# Altium project RPi_CWHUSKY_Target.PrjPcb
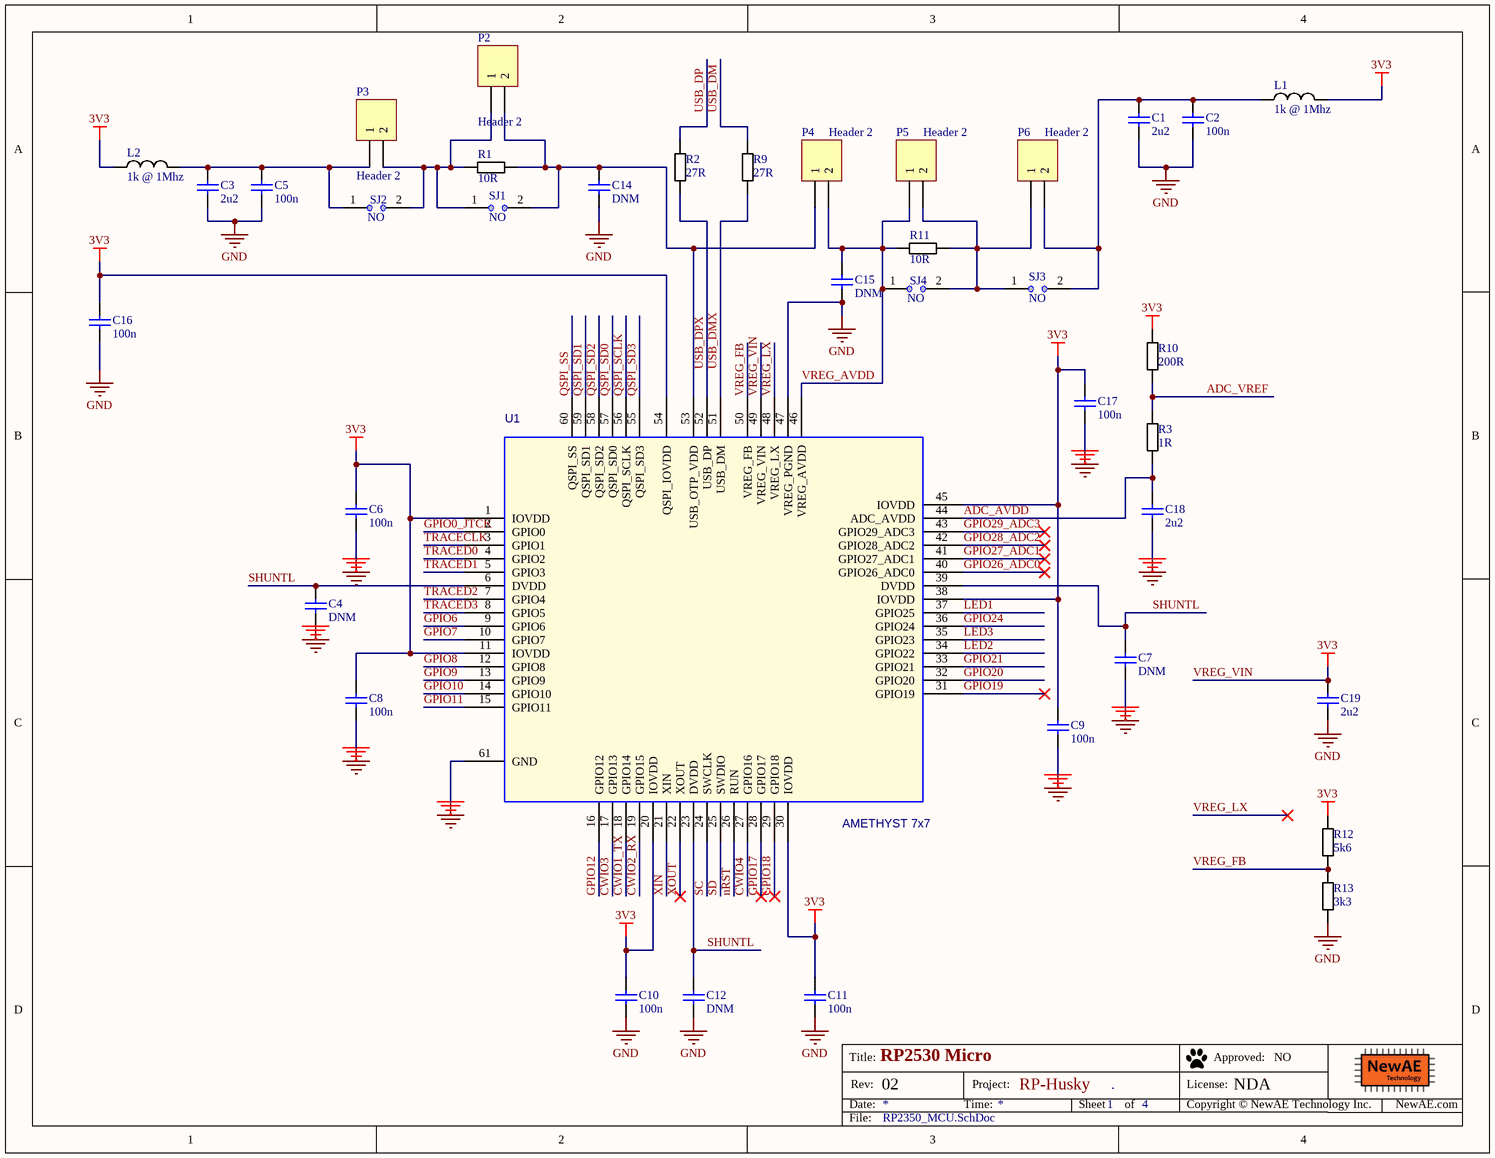
[diagram p0: RP2350_MCU.SchDoc]
PrjRev: 02; PrjName: RP-Husky; PrjLicense: NDA
4 sheets, 85 parts. Net scope: global (net labels, ports and power ports of the same name join across sheets).
Board file: RPi_CWHUSKY_Target.PcbDoc
Sheets:
  RP2350_MCU.SchDoc
  RP2350_CWHusky.SchDoc
  RP2350_Power.SchDoc
  RP2350_QSPI.SchDoc

## Sheet RP2350_MCU.SchDoc: RP2530 Micro
size Letter; Organization: NewAE Technology Inc.; Address1: 1083 Queen St., Suite 196; Address2: Halifax; Address3: NS; Address4: Canada B3H 0B2; DocumentNumber: .; Revision: .; SheetNumber: 1; SheetTotal: 4; SheetApproved: NO

### Parts
C1  2u2  [CAPC0603_M]
C2  100n  [CAPC0402_M]
C3  2u2  [CAPC0603_M]
C4  DNM  [CAPC0603_M]
C5  100n  [CAPC0402_M]
C6  100n  [CAPC0402_M]
C7  DNM  [CAPC0603_M]
C8  100n  [CAPC0402_M]
C9  100n  [CAPC0402_M]
C10  100n  [CAPC0402_M]
C11  100n  [CAPC0402_M]
C12  DNM  [CAPC0603_M]
C14  DNM  [CAPC0603_M]
C15  DNM  [CAPC0603_M]
C16  100n  [CAPC0402_M]
C17  100n  [CAPC0402_M]
C18  2u2  [CAPC0603_M]
C19  2u2  [CAPC0603_M]
L1  1k @ 1Mhz  [IND_0603]
L2  1k @ 1Mhz  [IND_0603]
P2  Header 2  [HDR1X2]
P3  Header 2  [HDR1X2]
P4  Header 2  [HDR1X2]
P5  Header 2  [HDR1X2]
P6  Header 2  [HDR1X2]
R1  10R  [RESC1608X55N]
R2  27R  [RESC1608X55N]
R3  1R  [RESC1608X55N]
R9  27R  [RESC1608X55N]
R10  200R  [RESC1608X55N]
R11  10R  [RESC1608X55N]
R12  5k6  [RESC1608X55N]
R13  3k3  [RESC1608X55N]
SJ1  NO  [SJ_2S_NO]  (no BOM)
SJ2  NO  [SJ_2S_NO]  (no BOM)
SJ3  NO  [SJ_2S_NO]  (no BOM)
SJ4  NO  [SJ_2S_NO]  (no BOM)
U1  AMETHYST 7x7  [QFN60P700X700X85_HS-61M]

### Nets
3V3: C6.1 C8.1 C9.1 C10.1 C11.1 C16.1 C17.1 C19.1 L1.2 L2.1 R10.1 R12.1 U1.1(IOVDD) U1.11(IOVDD) U1.20(IOVDD) U1.30(IOVDD) U1.38(IOVDD) U1.45(IOVDD) U1.49(VREG_VIN) U1.54(QSPI_IOVDD)  [also labelled VREG_VIN]  [project net IOVREF]
GND: C1.2 C2.2 C3.2 C4.2 C5.2 C6.2 C7.2 C8.2 C9.2 C10.2 C11.2 C12.2 C14.2 C15.2 C16.2 C17.2 C18.2 C19.2 R13.2 U1.47(VREG_PGND) U1.61(GND)
ADC_AVDD: C18.1 R3.1 U1.44(ADC_AVDD)
ADC_VREF: R3.2 R10.2
CWIO1_TX: U1.18(GPIO14)
CWIO2_RX: U1.19(GPIO15)
CWIO3: U1.17(GPIO13)
CWIO4: U1.27(GPIO16)
GPIO0_JTCK: U1.2(GPIO0)
GPIO6: U1.9(GPIO6)
GPIO7: U1.10(GPIO7)
GPIO8: U1.12(GPIO8)
GPIO9: U1.13(GPIO9)
GPIO10: U1.14(GPIO10)
GPIO11: U1.15(GPIO11)
GPIO12: U1.16(GPIO12)
GPIO17: U1.28(GPIO17)
GPIO18: U1.29(GPIO18)
GPIO19: U1.31(GPIO19)
GPIO20: U1.32(GPIO20)
GPIO21: U1.33(GPIO21)
GPIO24: U1.36(GPIO24)
GPIO26_ADC0: U1.40(GPIO26_ADC0)
GPIO27_ADC1: U1.41(GPIO27_ADC1)
GPIO28_ADC2: U1.42(GPIO28_ADC2)
GPIO29_ADC3: U1.43(GPIO29_ADC3)
LED1: U1.37(GPIO25)
LED2: U1.34(GPIO22)
LED3: U1.35(GPIO23)
nRST: U1.26(RUN)
QSPI_SCLK: U1.56(QSPI_SCLK)
QSPI_SD0: U1.57(QSPI_SD0)
QSPI_SD1: U1.59(QSPI_SD1)
QSPI_SD2: U1.58(QSPI_SD2)
QSPI_SD3: U1.55(QSPI_SD3)
QSPI_SS: U1.60(QSPI_SS)
SC: U1.24(SWCLK)
SD: U1.25(SWDIO)
SHUNTL: C4.1 C7.1 C12.1 U1.6(DVDD) U1.23(DVDD) U1.39(DVDD)
TRACECLK: U1.3(GPIO1)
TRACED0: U1.4(GPIO2)
TRACED1: U1.5(GPIO3)
TRACED2: U1.7(GPIO4)
TRACED3: U1.8(GPIO5)
USB_DM: R9.2
USB_DMX: R9.1 U1.51(USB_DM)
USB_DP: R2.2
USB_DPX: R2.1 U1.52(USB_DP)
VREG_AVDD: C15.1 P4.2 P5.1 R11.1 SJ4.1 U1.46(VREG_AVDD)
VREG_FB: R12.2 R13.1 U1.50(VREG_FB)
VREG_LX: U1.48(VREG_LX)
XIN: U1.21(XIN)
XOUT: U1.22(XOUT)
NetC1_1: C1.1 C2.1 L1.1 P6.2 SJ3.2
NetC3_1: C3.1 C5.1 L2.2 P3.1 SJ2.1
NetC14_1: C14.1 P2.2 P4.1 R1.2 SJ1.2 U1.53(USB_OTP_VDD)
NetP2_1: P2.1 P3.2 R1.1 SJ1.1 SJ2.2
NetP5_2: P5.2 P6.1 R11.2 SJ3.1 SJ4.2

### Notes on the sheet
- Title:
- Date:
- Rev:
- Time:
- Project:
- Sheet
- of
- License:
- Copyright © NewAE Technology Inc.
- Approved:
- NewAE.com
- File:

### Library data of the parts
C1 C3 C18 C19 = CCHIP-2u2-0603: 2u2, 0603; Manufacture 1: Samsung; Manufacture Part Number 1: CL10B225KP8NNNC; Component Group: Capacitor; Case-EIA: 0603; Case-Metric: 1608; Rated Voltage: 10VDC; Part Number: CCHIP-2u2-0603; Footprint: 0603; Pin Count: 2; Supplier 1: Digi-Key; Supplier Part Number 1: 1276-1134-1-ND; Value: 2u2; Mounting Technology: SMT; Component Kind: Standard; Component Type: Standard
C2 C5 C6 C8-C11 C16 C17 = CCHIP-100n-0402: 100n, 0402; Manufacture Part Number 1: CGA2B3X7R1V104K050BB; Component Group: Capacitor; Case-EIA: 0402; Part Number: CCHIP-100n-0402; Footprint: 0402; Pin Count: 2; Supplier 1: Digi-Key; Supplier Part Number 1: 445-6901-1-ND; Value: 100n; Mounting Technology: SMT; Component Kind: Standard; Component Type: Standard
C4 C7 C12 C14 C15 = CCHIP-DNM-0603: DNM, 0603; Component Group: Capacitor; Case-EIA: 0603; Part Number: CCHIP-DNM-0603; Footprint: 0603; Pin Count: 2; Value: DNM; Mounting Technology: SMT; Component Kind: Standard; Component Type: Standard
L1 L2 = FBCHIP-1k-0603: Ferrite Beads HI CUR CHIP BD 0603 1000OHMS 25%; Manufacture 1: Taiyo Yuden; Manufacture Part Number 1: FBMH1608HM102-T / FBMH1608HM102-T / FBMH1608HM102-T / FBMH1608HM102-T; Component Group: Inductor; PP Material Stack: 0; Part Number: FBCHIP-1k-0603; Footprint: 0603; Pin Count: 2; Supplier 1: Mouser; Supplier Part Number 1: 963-FBMH1608HM102-T; Mounting Technology: SMT; RoHS: Yes; Component Kind: Standard; Component Type: Standard; PP Rotation: 0
P2-P6 = Header 2: Header, 2-Pin; LatestRevisionDate: 17-Jul-2002; LatestRevisionNote: Re-released for DXP Platform.; Publisher: Altium Limited
R1 R11 = RCHIP-10R-0603: 10R res, 0603, 1%, 1/10W; Manufacture 1: Yageo; Manufacture Part Number 1: RC0603FR-0710RL; Component Group: Resistor; Case-EIA: 0603; Case-Metric: 1608; Rated Power: 0.1W; Rated Voltage: 75VDC; Part Number: RCHIP-10R-0603; Footprint: 0603; Pin Count: 2; Supplier 1: Digi-Key; Supplier Part Number 1: 311-10.0HRCT-ND; Value: 10R; Tolerance: 1%; Mounting Technology: SMT; Temperature Range: -55C to 155C; Component Kind: Standard; Component Type: Standard
R2 R9 = RCHIP-27R-0603: 27R res, 0603, 1%, 1/10W; Manufacture 1: Yageo; Manufacture Part Number 1: RC0603FR-0727RL; Component Group: Resistor; Case-EIA: 0603; Case-Metric: 1608; Rated Power: 0.1W; Rated Voltage: 75VDC; Part Number: RCHIP-27R-0603; Footprint: 0603; Pin Count: 2; Supplier 1: Digi-Key; Supplier Part Number 1: 311-27.0HRCT-ND; Value: 27R; Tolerance: 1%; Mounting Technology: SMT; Temperature Range: -55C to 155C; Component Kind: Standard; Component Type: Standard
R3 = RCHIP-10R-0603: 1R res, 0603, 1%, 1/10W; Manufacture 1: Yageo; Manufacture Part Number 1: RC0603FR-0710RL; Component Group: Resistor; Value: 10R; Case-EIA: 0603; Case-Metric: 1608; Rated Power: 0.1W; Rated Voltage: 75VDC; Part Number: RCHIP-10R-0603; Footprint: 0603; Pin Count: 2; Supplier 1: Digi-Key; Supplier Part Number 1: 311-10.0HRCT-ND; Tolerance: 1%; Mounting Technology: SMT; Temperature Range: -55C to 155C; Component Kind: Standard; Component Type: Standard
R10 = RCHIP-200R-0603: 200R res, 0603, 1%, 1/10W; Manufacture 1: Yageo; Manufacture Part Number 1: RC0603FR-07200RL; Component Group: Resistor; Case-EIA: 0603; Case-Metric: 1608; Rated Power: 0.1W; Rated Voltage: 75VDC; Part Number: RCHIP-200R-0603; Footprint: 0603; Pin Count: 2; Supplier 1: Digi-Key; Supplier Part Number 1: 311-200HRCT-ND; Value: 200R; Tolerance: 1%; Mounting Technology: SMT; Temperature Range: -55C to 155C; Component Kind: Standard; Component Type: Standard
R12 = RCHIP-5k6-0603: 5k6 res, 0603, 1%, 1/10W; Manufacture 1: Yageo; Manufacture Part Number 1: RC0603FR-075K6L; Component Group: Resistor; Case-EIA: 0603; Case-Metric: 1608; Rated Power: 0.1W; Rated Voltage: 75VDC; Part Number: RCHIP-5K6-0603; Footprint: 0603; Pin Count: 2; Mounting Technology: SMT; Component Kind: Standard; Component Type: Standard; Supplier 1: Digi-Key; Supplier Part Number 1: 311-5.60KHRCT-ND; Value: 5k6; Tolerance: 1%; Temperature Range: -55C to 155C
R13 = RCHIP-3k3-0603: 3k3 res, 0603, 1%, 1/10W; Manufacture 1: Yageo; Manufacture Part Number 1: RC0603FR-073K3L; Component Group: Resistor; Case-EIA: 0603; Case-Metric: 1608; Rated Power: 0.1W; Rated Voltage: 75VDC; Part Number: RCHIP-3K3-0603; Footprint: 0603; Pin Count: 2; Mounting Technology: SMT; Component Kind: Standard; Component Type: Standard; Supplier 1: Digi-Key; Supplier Part Number 1: 311-3.30KHRCT-ND; Value: 3k3; Tolerance: 1%; Temperature Range: -55C to 155C
SJ1-SJ4 = SJ_2S_NO: Solder Jumper, NO; Component Group: PCB Feature; Part Number: SJ_2S_NO; Pin Count: 2; Mounting Technology: COPPER; Component Type: Standard (No BOM)
U1 = RPI_AMETHYST-7X7: Part Reference: U1; PCB Footprint: rpi-amethyst-7x7qfn; Value: AMETHYST 7x7

## Sheet RP2350_CWHusky.SchDoc: CWHusky Edge Connector
size Letter; Organization: NewAE Technology Inc.; Address1: 1083 Queen St., Suite 196; Address2: Halifax; Address3: NS; Address4: Canada B3H 0B2; DocumentNumber: .; Revision: .; SheetNumber: 2; SheetTotal: 4; SheetApproved: NO
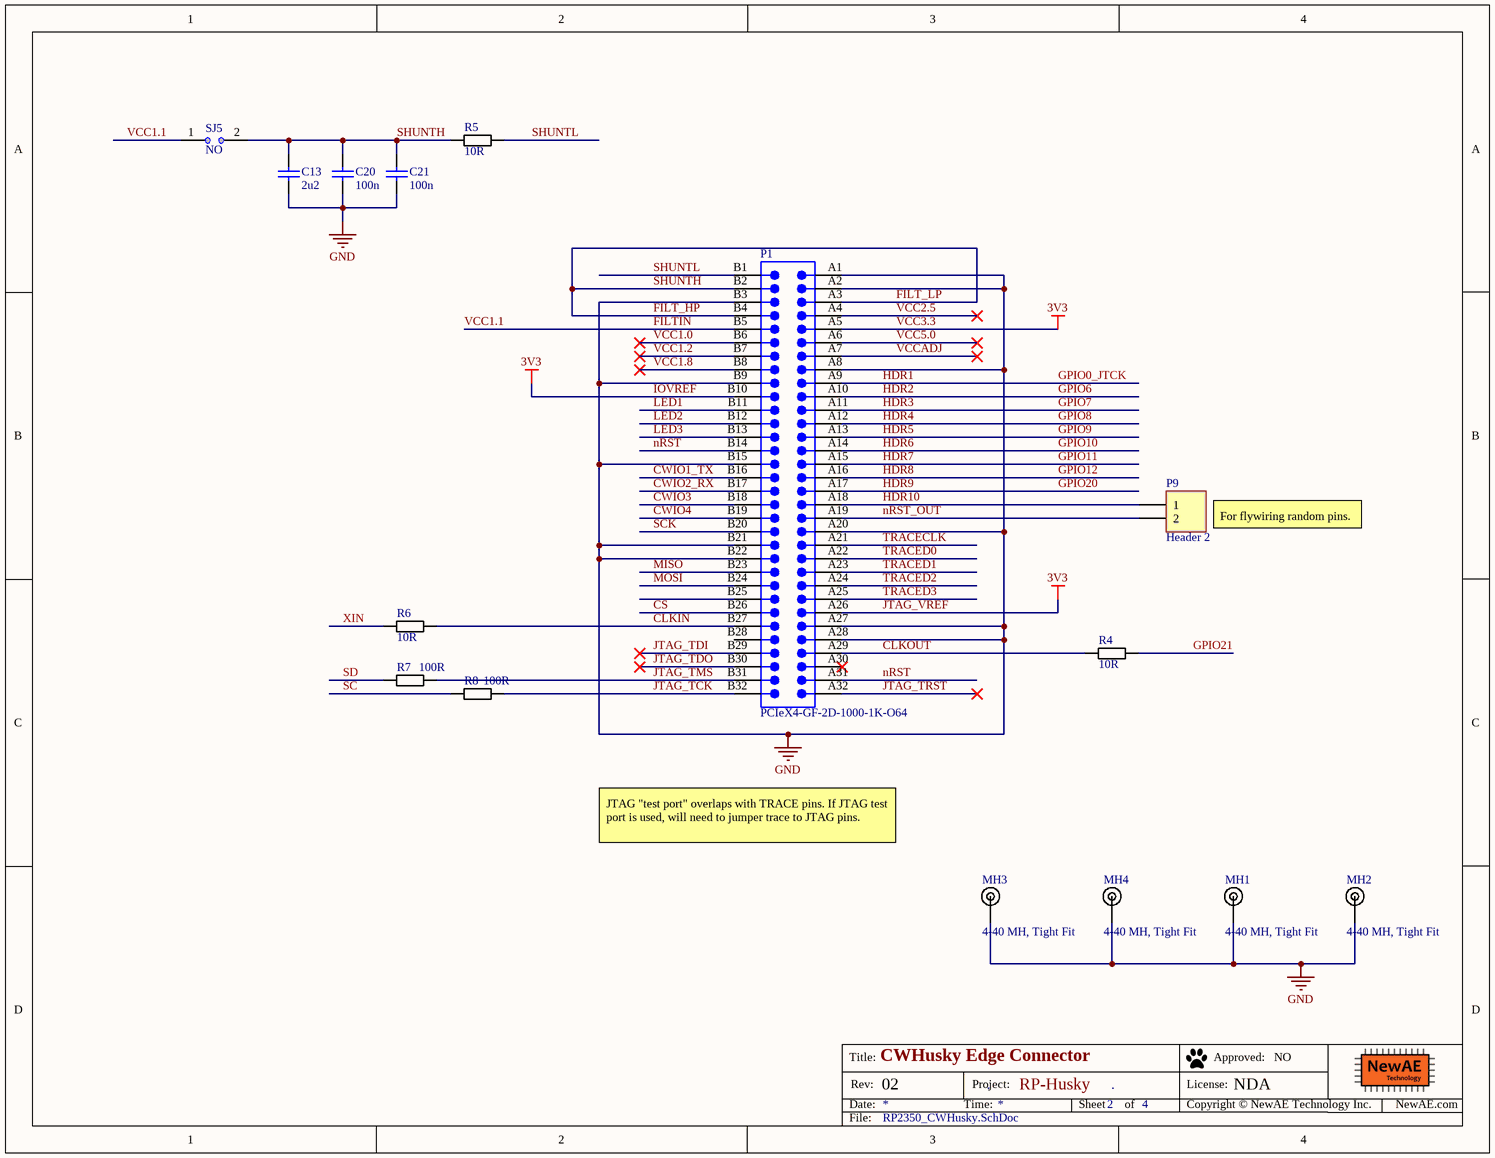
[diagram p1: RP2350_CWHusky.SchDoc]

### Parts
C13  2u2  [CAPC0603_M]
C20  100n  [CAPC0603_M]
C21  100n  [CAPC0603_M]
MH1  4-40 MH, Tight Fit  [MOUNT_#4_TIGHT]
MH2  4-40 MH, Tight Fit  [MOUNT_#4_TIGHT]
MH3  4-40 MH, Tight Fit  [MOUNT_#4_TIGHT]
MH4  4-40 MH, Tight Fit  [MOUNT_#4_TIGHT]
P1  PCIeX4-GF-2D-1000-1K-O64  [PCIeX4-GF-2D-1000-1K-O64]  (no BOM)
P9  Header 2  [HDR1X2]
R4  10R  [RESC1608X55N]
R5  10R  [RESC1608X55N]
R6  10R  [RESC1608X55N]
R7  100R  [RESC1608X55N]
R8  100R  [RESC1608X55N]
SJ5  NO  [SJ_2S_NO]  (no BOM)

### Nets
GND: C13.2 C20.2 C21.2 MH1.1 MH2.1 MH3.1 MH4.1 P1.A1 P1.A2 P1.A8 P1.A20 P1.A27 P1.A28 P1.B3 P1.B9 P1.B15 P1.B21 P1.B22
IOVREF: P1.A5 P1.A26 P1.B10  [also labelled 3V3, JTAG_VREF, VCC3.3]
CLKIN: P1.B27 R6.2
CLKOUT: P1.A29 R4.1
CS: P1.B26
CWIO1_TX: P1.B16
CWIO2_RX: P1.B17
CWIO3: P1.B18
CWIO4: P1.B19
FILT_HP: C13.1 C20.1 C21.1 P1.A3 P1.B2 P1.B4 R5.1 SJ5.2  [also labelled FILT_LP, SHUNTH]
FILTIN: P1.B5 SJ5.1  [also labelled VCC1.1]
GPIO0_JTCK: P1.A9  [also labelled HDR1]
GPIO6: P1.A10  [also labelled HDR2]
GPIO7: P1.A11  [also labelled HDR3]
GPIO8: P1.A12  [also labelled HDR4]
GPIO9: P1.A13  [also labelled HDR5]
GPIO10: P1.A14  [also labelled HDR6]
GPIO11: P1.A15  [also labelled HDR7]
GPIO12: P1.A16  [also labelled HDR8]
GPIO20: P1.A17  [also labelled HDR9]
GPIO21: R4.2
HDR10: P1.A18 P9.1
JTAG_TCK: P1.B32 R8.2
JTAG_TDI: P1.B29
JTAG_TDO: P1.B30
JTAG_TMS: P1.B31 R7.2
JTAG_TRST: P1.A32
LED1: P1.B11
LED2: P1.B12
LED3: P1.B13
MISO: P1.B23
MOSI: P1.B24
nRST: P1.A31 P1.B14
nRST_OUT: P1.A19 P9.2
SC: R8.1
SCK: P1.B20
SD: R7.1
SHUNTL: P1.B1 R5.2
TRACECLK: P1.A21
TRACED0: P1.A22
TRACED1: P1.A23
TRACED2: P1.A24
TRACED3: P1.A25
VCC1.0: P1.B6
VCC1.2: P1.B7
VCC1.8: P1.B8
VCC2.5: P1.A4
VCC5.0: P1.A6
VCCADJ: P1.A7
XIN: R6.1

Not connected (* = marked no-connect by the designer): P1 A30* B25 B28

### Notes on the sheet
- (near P9) For flywiring random pins.
- JTAG "test port" overlaps with TRACE pins. If JTAG test port is used, will need to jumper trace to JTAG pins.
- Title:
- Date:
- Rev:
- Time:
- Project:
- Sheet
- of
- License:
- Copyright © NewAE Technology Inc.
- Approved:
- NewAE.com
- File:

### Library data of the parts
C13 = CCHIP-2u2-0603: as C1 on sheet RP2350_MCU; Part Number: CCHIP-2u2-0603; Footprint: 0603; Pin Count: 2; Supplier 1: Digi-Key; Supplier Part Number 1: 1276-1134-1-ND; Value: 2u2; Mounting Technology: SMT; Component Kind: Standard; Component Type: Standard
C20 C21 = CCHIP-100n-0603: 100n, 0603; Manufacture 1: Kemet; Manufacture Part Number 1: C0603C104K5RACTU; Component Group: Capacitor; Case-EIA: 0603; Case-Metric: 1608; Rated Voltage: 50VDC; Part Number: CCHIP-100n-0603; Footprint: 0603; Pin Count: 2; Supplier 1: Digi-Key; Supplier Part Number 1: 399-5089-2-ND; Value: 100n; Mounting Technology: SMT; Component Kind: Standard; Component Type: Standard
MH1-MH4 = MOUNT_#4_TIGHT: Machine screw 4-40 Mounting Hole; Component Group: Mechanical; PP Material Stack: 0; Part Number: MOUNT_#4_TIGHT; Pin Count: 1; Component Kind: Mechanical; Component Type: Mechanical; PP Rotation: 0
P1 = CMP-0001-00031-2: Golden finger, PCIeX4, Dual, Opposite, Pitch 1mm, 64-Position; Mating Connector: Molex-87715-9106; Publisher: Altium; ClassName: Edge Connector; Datasheet Version: rev2.0, Apr-2007; Package Reference: PCIeX4-GF-2D-1000-1K-O64
P9 = Header 2: Header, 2-Pin; LatestRevisionDate: 17-Jul-2002; LatestRevisionNote: Re-released for DXP Platform.; Publisher: Altium Limited
R4-R6 = RCHIP-10R-0603: as R1 on sheet RP2350_MCU; Part Number: RCHIP-10R-0603; Footprint: 0603; Pin Count: 2; Supplier 1: Digi-Key; Supplier Part Number 1: 311-10.0HRCT-ND; Value: 10R; Tolerance: 1%; Mounting Technology: SMT; Temperature Range: -55C to 155C; Component Kind: Standard; Component Type: Standard
R7 R8 = RCHIP-100R-0603: 100R res, 0603, 1%, 1/10W; Manufacture 1: Yageo; Manufacture Part Number 1: RC0603FR-07100RL; Component Group: Resistor; Case-EIA: 0603; Case-Metric: 1608; Rated Power: 0.1W; Rated Voltage: 75VDC; Part Number: RCHIP-100R-0603; Footprint: 0603; Pin Count: 2; Supplier 1: Digi-Key; Supplier Part Number 1: 311-100HRCT-ND; Value: 100R; Tolerance: 1%; Mounting Technology: SMT; Temperature Range: -55C to 155C; Component Kind: Standard; Component Type: Standard
SJ5 = SJ_2S_NO: as SJ1 on sheet RP2350_MCU; Part Number: SJ_2S_NO; Pin Count: 2; Mounting Technology: COPPER; Component Type: Standard (No BOM)

## Sheet RP2350_Power.SchDoc: Power and USB
size Letter; Organization: NewAE Technology Inc.; Address1: 1083 Queen St., Suite 196; Address2: Halifax; Address3: NS; Address4: Canada B3H 0B2; DocumentNumber: .; Revision: .; SheetNumber: 3; SheetTotal: 4; SheetApproved: NO
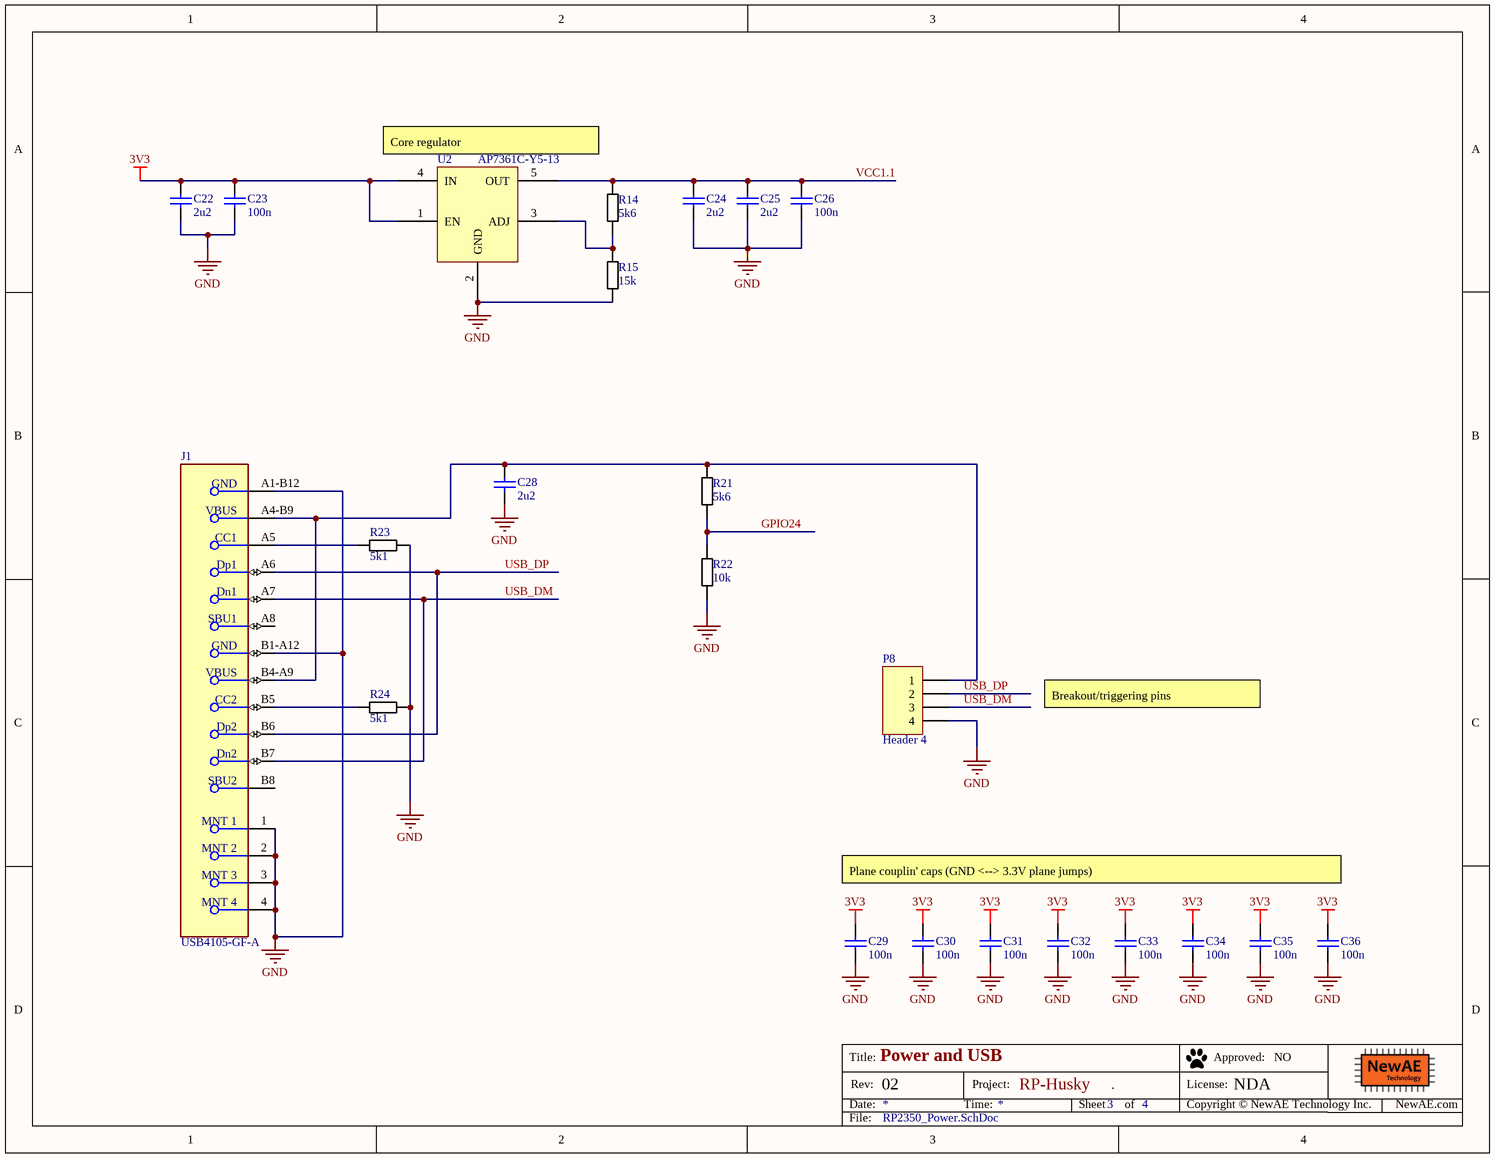
[diagram p2: RP2350_Power.SchDoc]

### Parts
C22  2u2  [CAPC0603_M]
C23  100n  [CAPC0402_M]
C24  2u2  [CAPC0603_M]
C25  2u2  [CAPC0603_M]
C26  100n  [CAPC0402_M]
C28  2u2  [CAPC0603_M]
C29  100n  [CAPC0402_M]
C30  100n  [CAPC0402_M]
C31  100n  [CAPC0402_M]
C32  100n  [CAPC0402_M]
C33  100n  [CAPC0402_M]
C34  100n  [CAPC0402_M]
C35  100n  [CAPC0402_M]
C36  100n  [CAPC0402_M]
J1  USB4105-GF-A  [FP-USB4105-GF-A-MFG]
P8  Header 4  [HDR1X4]
R14  5k6  [RESC1608X55N]
R15  15k  [RESC1608X55N]
R21  5k6  [RESC1608X55N]
R22  10k  [RESC1608X55N]
R23  5k1  [RESC1608X55N]
R24  5k1  [RESC1608X55N]
U2  AP7361C-Y5-13  [SOT89-5]

### Nets
3V3: C22.1 C23.1 C29.1 C30.1 C31.1 C32.1 C33.1 C34.1 C35.1 C36.1 U2.1(EN) U2.4(IN)  [project net IOVREF]
GND: C22.2 C23.2 C24.2 C25.2 C26.2 C28.2 C29.2 C30.2 C31.2 C32.2 C33.2 C34.2 C35.2 C36.2 J1.1(MNT_1) J1.2(MNT_2) J1.3(MNT_3) J1.4(MNT_4) J1.A1-B12(GND) J1.B1-A12(GND) P8.4 R15.2 R22.2 R23.2 R24.2 U2.2(GND)
GPIO24: R21.2 R22.1
USB_DM: J1.A7(Dn1) J1.B7(Dn2) P8.3
USB_DP: J1.A6(Dp1) J1.B6(Dp2) P8.2
VCC1.1: C24.1 C25.1 C26.1 R14.1 U2.5(OUT)  [project net FILTIN]
NetC28_1: C28.1 J1.A4-B9(VBUS) J1.B4-A9(VBUS) P8.1 R21.1
NetJ1_A5: J1.A5(CC1) R23.1
NetJ1_B5: J1.B5(CC2) R24.1
NetR14_2: R14.2 R15.1 U2.3(ADJ)

Not connected (* = marked no-connect by the designer): J1 A8(SBU1) B8(SBU2)

### Notes on the sheet
- Core regulator
- Breakout/triggering pins
- Plane couplin' caps (GND <--> 3.3V plane jumps)
- Title:
- Date:
- Rev:
- Time:
- Project:
- Sheet
- of
- License:
- Copyright © NewAE Technology Inc.
- Approved:
- NewAE.com
- File:

### Library data of the parts
C22 C24 C25 C28 = CCHIP-2u2-0603: as C1 on sheet RP2350_MCU; Part Number: CCHIP-2u2-0603; Footprint: 0603; Pin Count: 2; Supplier 1: Digi-Key; Supplier Part Number 1: 1276-1134-1-ND; Value: 2u2; Mounting Technology: SMT; Component Kind: Standard; Component Type: Standard
C23 C26 C29-C36 = CCHIP-100n-0402: as C2 on sheet RP2350_MCU; Part Number: CCHIP-100n-0402; Footprint: 0402; Pin Count: 2; Supplier 1: Digi-Key; Supplier Part Number 1: 445-6901-1-ND; Value: 100n; Mounting Technology: SMT; Component Kind: Standard; Component Type: Standard
J1 = CMP-245163-000001-1: CONN RCPT USB2.0 TYPEC 5A; Manufacturer: GCT; Voltage Rating: 20V; Is Female: yes; Current Rating: 5/6.25/1.25/0.25A; Number Of Contacts: 16; Conn Orientation: Right Angle; Device Class L1: Connectors; Category: Conn; Lead Free: Yes; RoHS: TRUE; Temperature Range High: +85°C; Digikey Description: CONN RCPT USB2.0 TYPEC 5A; Device Class L3: unset; ComponentLink2Description: Datasheet; Manufacturer Part Number: USB4105-GF-A; Package: 0; Usb Standard: USB 2.0; Device Class L2: USB Connectors; Automotive: No; Temperature Range Low: -40°C; Height: 3.46mm; Temperature: -40°C to +85°C; Contact Material: Gold,Nickel; ComponentLink2URL: https://gct.co/files/drawings/usb4105.pdf; Octopart: https://octopart.com/usb4105-gf-a-gct-106627878
P8 = Header 4: Header, 4-Pin; LatestRevisionDate: 17-Jul-2002; LatestRevisionNote: Re-released for DXP Platform.; Publisher: Altium Limited
R14 R21 = RCHIP-5K6-0603: 5k6 res, 0603, 1%, 1/10W; Manufacture 1: Yageo; Manufacture Part Number 1: RC0603FR-075K6L; Component Group: Resistor; Case-EIA: 0603; Case-Metric: 1608; Rated Power: 0.1W; Rated Voltage: 75VDC; Part Number: RCHIP-5K6-0603; Footprint: 0603; Pin Count: 2; Mounting Technology: SMT; Component Kind: Standard; Component Type: Standard; Supplier 1: Digi-Key; Supplier Part Number 1: 311-5.60KHRCT-ND; Value: 5k6; Tolerance: 1%; Temperature Range: -55C to 155C
R15 = RCHIP-15k-0603: 15k res, 0603, 1%, 1/10W; Manufacture 1: Yageo; Manufacture Part Number 1: RC0603FR-0715KL; Component Group: Resistor; Case-EIA: 0603; Case-Metric: 1608; Rated Power: 0.1W; Rated Voltage: 75VDC; Part Number: RCHIP-15K-0603; Footprint: 0603; Pin Count: 2; Mounting Technology: SMT; Component Kind: Standard; Component Type: Standard; Supplier 1: Digi-Key; Supplier Part Number 1: 311-15.0KHRCT-ND; Value: 15k; Tolerance: 1%; Temperature Range: -55C to 155C
R22 = RCHIP-10K-0603: 10k res, 0603, 1%, 1/10W; Manufacture 1: Yageo; Manufacture Part Number 1: RC0603FR-0710KL; Component Group: Resistor; Case-EIA: 0603; Case-Metric: 1608; Rated Power: 0.1W; Rated Voltage: 75VDC; Part Number: RCHIP-10K-0603; Footprint: 0603; Pin Count: 2; Supplier 1: Digi-Key; Supplier Part Number 1: 311-10.0KHRCT-ND; Value: 10k; Tolerance: 1%; Mounting Technology: SMT; Temperature Range: -55C to 155C; Component Kind: Standard; Component Type: Standard
R23 R24 = RCHIP-5K1-0603: 5k1 res, 0603, 1%, 1/10W; Manufacture 1: Yageo; Manufacture Part Number 1: RC0603FR-075K1L; Component Group: Resistor; Case-EIA: 0603; Case-Metric: 1608; Rated Power: 0.1W; Rated Voltage: 75VDC; Part Number: RCHIP-5K1-0603; Footprint: 0603; Pin Count: 2; Supplier 1: Digi-Key; Supplier Part Number 1: 311-5.10KHRCT-ND; Value: 5k1; Tolerance: 1%; Mounting Technology: SMT; Temperature Range: -55C to 155C; Component Kind: Standard; Component Type: Standard
U2 = AP7361C-Y5-13: Regulator, Adj, LDO, 1A; Manufacture 1: Diodes Inc; Component Group: Analog IC; PP Material Stack: 0; Part Number: AP7361C-Y5-13; Manufacture Part Number 1: AP7361C-Y5-13; Pin Count: 5; Supplier 1: Digi-Key; Supplier Part Number 1: AP7361C-Y5-13DICT-ND; Component Kind: Standard; Component Type: Standard; PP Rotation: 0; PP Rotation1: 0

## Sheet RP2350_QSPI.SchDoc: QSPI Memory
size Letter; Organization: NewAE Technology Inc.; Address1: 1083 Queen St., Suite 196; Address2: Halifax; Address3: NS; Address4: Canada B3H 0B2; DocumentNumber: .; Revision: .; SheetNumber: 4; SheetTotal: 4; SheetApproved: NO
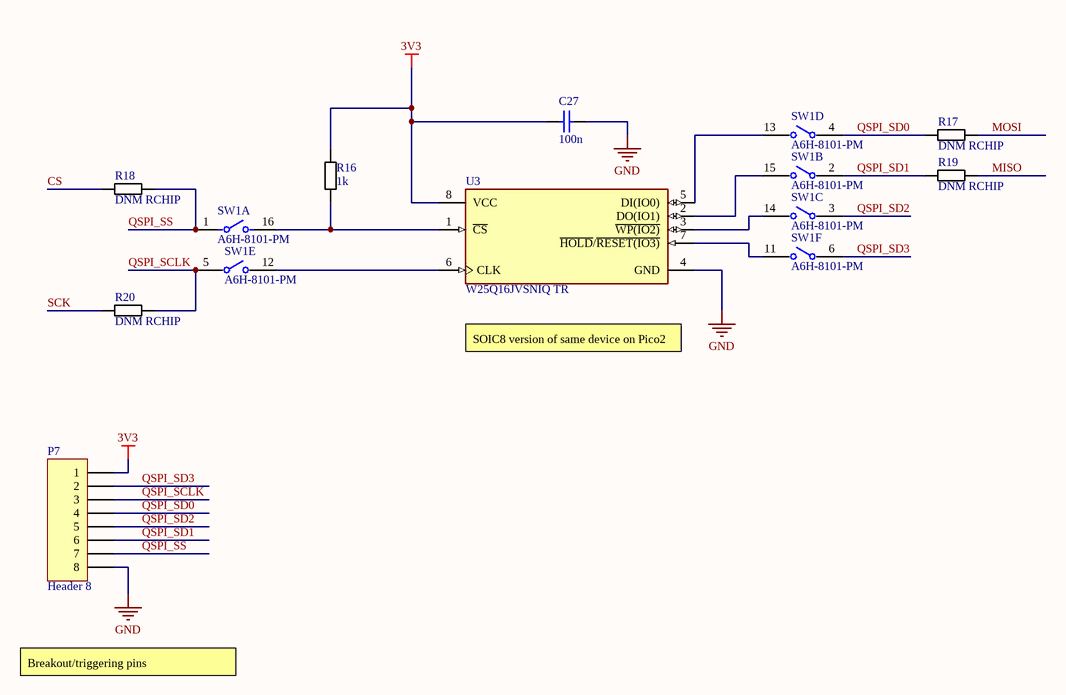
[diagram p3: RP2350_QSPI.SchDoc]

### Parts
C27  100n  [CAPC0603_M]
P7  Header 8  [HDR1X8]
R16  1k  [RESC1608X55N]
R17  DNM RCHIP  [RESC1608X55N]
R18  DNM RCHIP  [RESC1608X55N]
R19  DNM RCHIP  [RESC1608X55N]
R20  DNM RCHIP  [RESC1608X55N]
SW1  A6H-8101-PM  [FP-A6H-8101-PM-MFG]  (parts A,B,C,D,E,F of 8)
U3  W25Q16JVSNIQ TR  [FP-W25Q16JVSNIQ_TR-IPC_A]

### Nets
3V3: C27.1 P7.1 R16.1 U3.8(VCC)  [project net IOVREF]
GND: C27.2 P7.8 U3.4(GND)
CS: R18.1
MISO: R19.2
MOSI: R17.2
QSPI_SCLK: P7.3 R20.2 SW1.5
QSPI_SD0: P7.4 R17.1 SW1.4
QSPI_SD1: P7.6 R19.1 SW1.2
QSPI_SD2: P7.5 SW1.3
QSPI_SD3: P7.2 SW1.6
QSPI_SS: P7.7 R18.2 SW1.1
SCK: R20.1
NetR16_2: R16.2 SW1.16 U3.1(~{CS})
NetSW1_11: SW1.11 U3.7(~{HOLD}/~{RESET(IO3)})
NetSW1_12: SW1.12 U3.6(CLK)
NetSW1_13: SW1.13 U3.5(DI(IO0))
NetSW1_14: SW1.14 U3.3(~{WP(IO2)})
NetSW1_15: SW1.15 U3.2(DO(IO1))

### Notes on the sheet
- SOIC8 version of same device on Pico2
- Breakout/triggering pins
- Title:
- Date:
- Rev:
- Time:
- Project:
- Sheet
- of
- License:
- Copyright © NewAE Technology Inc.
- Approved:
- NewAE.com
- File:

### Library data of the parts
C27 = CCHIP-100n-0603: as C20 on sheet RP2350_CWHusky; Part Number: CCHIP-100n-0603; Footprint: 0603; Pin Count: 2; Supplier 1: Digi-Key; Supplier Part Number 1: 399-5089-2-ND; Value: 100n; Mounting Technology: SMT; Component Kind: Standard; Component Type: Standard
P7 = Header 8: Header, 8-Pin; LatestRevisionDate: 17-Jul-2002; LatestRevisionNote: Re-released for DXP Platform.; Publisher: Altium Limited
R16 = RCHIP-1K-0603: 1k res, 0603, 1%, 1/10W; Manufacture 1: Yageo; Manufacture Part Number 1: RC0603FR-071KL; Component Group: Resistor; Case-EIA: 0603; Case-Metric: 1608; Rated Power: 0.1W; Rated Voltage: 75VDC; Part Number: RCHIP-1K-0603; Footprint: 0603; Pin Count: 2; Supplier 1: Digi-Key; Supplier Part Number 1: 311-1.00KHRCT-ND; Value: 1k; Tolerance: 1%; Mounting Technology: SMT; Temperature Range: -55C to 155C; Component Kind: Standard; Component Type: Standard
R17-R20 = RCHIP-DNM-0603: Do Not Mount Resistor; Case-EIA: 0603; Case-Metric: 1608; Part Number: RCHIP-DNM-0603; Component Group: Resistor; Footprint: 0603; Pin Count: 2; Mounting Technology: SMT; Component Kind: Standard; Component Type: Standard
SW1 = CMP-08827-000045-1: SWITCH SLIDE DIP SPST 25MA 24V; Number of Positions: 8; Actuator Type: Slide (Standard); Mechanical Life: 1000Cycles; Pitch: 0.05inch; Washable: No; Radiation Hardening: No; Max Operating Temperature: 70°C; Packaging: Tape and Reel; Max Current Rating: 25mA; Mount: Surface Mount; Voltage Rating (DC): 24V; Package Quantity: 4000; Length: 0.448inch; Depth: 6.7mm; Orientation: Straight; Throw Configuration: SPST; Termination: Gull Wing; Max Voltage Rating (DC): 24V; Series: A6H; Min Operating Temperature: -20°C; Current Rating: 25mA; Electrical Life: 1000Cycles
U3 = CMP-78876-000009-2: IC FLASH 16MBIT SPI/QUAD 8SOIC; NexarPartId: 75645707; Max Supply Voltage: 3.6V; Memory Size: 2MB; Interface: SPI; Access Time: 5ms; Min Supply Voltage: 2.7V; RoHS: Non-Compliant; Min Operating Temperature: -40°C; Memory Type: FLASH; Height: 1.75mm; Schedule B: 8542320070, 8542320070; Ambient Temperature Range High: 85°C; Max Operating Temperature: 85°C

## Nets that join several sheets
GND: RP2350_MCU (21 pins), RP2350_CWHusky (18 pins), RP2350_Power (26 pins), RP2350_QSPI (C27.2 P7.8 U3.4)
IOVREF: RP2350_MCU (20 pins), RP2350_CWHusky (P1.A5 P1.A26 P1.B10), RP2350_Power (12 pins), RP2350_QSPI (C27.1 P7.1 R16.1 U3.8)
CS: RP2350_CWHusky (P1.B26), RP2350_QSPI (R18.1)
CWIO1_TX: RP2350_MCU (U1.18), RP2350_CWHusky (P1.B16)
CWIO2_RX: RP2350_MCU (U1.19), RP2350_CWHusky (P1.B17)
CWIO3: RP2350_MCU (U1.17), RP2350_CWHusky (P1.B18)
CWIO4: RP2350_MCU (U1.27), RP2350_CWHusky (P1.B19)
FILTIN: RP2350_CWHusky (P1.B5 SJ5.1), RP2350_Power (5 pins)
GPIO0_JTCK: RP2350_MCU (U1.2), RP2350_CWHusky (P1.A9)
GPIO6: RP2350_MCU (U1.9), RP2350_CWHusky (P1.A10)
GPIO7: RP2350_MCU (U1.10), RP2350_CWHusky (P1.A11)
GPIO8: RP2350_MCU (U1.12), RP2350_CWHusky (P1.A12)
GPIO9: RP2350_MCU (U1.13), RP2350_CWHusky (P1.A13)
GPIO10: RP2350_MCU (U1.14), RP2350_CWHusky (P1.A14)
GPIO11: RP2350_MCU (U1.15), RP2350_CWHusky (P1.A15)
GPIO12: RP2350_MCU (U1.16), RP2350_CWHusky (P1.A16)
GPIO20: RP2350_MCU (U1.32), RP2350_CWHusky (P1.A17)
GPIO21: RP2350_MCU (U1.33), RP2350_CWHusky (R4.2)
GPIO24: RP2350_MCU (U1.36), RP2350_Power (R21.2 R22.1)
LED1: RP2350_MCU (U1.37), RP2350_CWHusky (P1.B11)
LED2: RP2350_MCU (U1.34), RP2350_CWHusky (P1.B12)
LED3: RP2350_MCU (U1.35), RP2350_CWHusky (P1.B13)
MISO: RP2350_CWHusky (P1.B23), RP2350_QSPI (R19.2)
MOSI: RP2350_CWHusky (P1.B24), RP2350_QSPI (R17.2)
nRST: RP2350_MCU (U1.26), RP2350_CWHusky (P1.A31 P1.B14)
QSPI_SCLK: RP2350_MCU (U1.56), RP2350_QSPI (P7.3 R20.2 SW1.5)
QSPI_SD0: RP2350_MCU (U1.57), RP2350_QSPI (P7.4 R17.1 SW1.4)
QSPI_SD1: RP2350_MCU (U1.59), RP2350_QSPI (P7.6 R19.1 SW1.2)
QSPI_SD2: RP2350_MCU (U1.58), RP2350_QSPI (P7.5 SW1.3)
QSPI_SD3: RP2350_MCU (U1.55), RP2350_QSPI (P7.2 SW1.6)
QSPI_SS: RP2350_MCU (U1.60), RP2350_QSPI (P7.7 R18.2 SW1.1)
SC: RP2350_MCU (U1.24), RP2350_CWHusky (R8.1)
SCK: RP2350_CWHusky (P1.B20), RP2350_QSPI (R20.1)
SD: RP2350_MCU (U1.25), RP2350_CWHusky (R7.1)
SHUNTL: RP2350_MCU (6 pins), RP2350_CWHusky (P1.B1 R5.2)
TRACECLK: RP2350_MCU (U1.3), RP2350_CWHusky (P1.A21)
TRACED0: RP2350_MCU (U1.4), RP2350_CWHusky (P1.A22)
TRACED1: RP2350_MCU (U1.5), RP2350_CWHusky (P1.A23)
TRACED2: RP2350_MCU (U1.7), RP2350_CWHusky (P1.A24)
TRACED3: RP2350_MCU (U1.8), RP2350_CWHusky (P1.A25)
USB_DM: RP2350_MCU (R9.2), RP2350_Power (J1.A7 J1.B7 P8.3)
USB_DP: RP2350_MCU (R2.2), RP2350_Power (J1.A6 J1.B6 P8.2)
XIN: RP2350_MCU (U1.21), RP2350_CWHusky (R6.1)